# Altium schematic sheet Servo4.SchDoc
size 420 x 297 mm; SheetNumber: 27; SheetTotal: 32
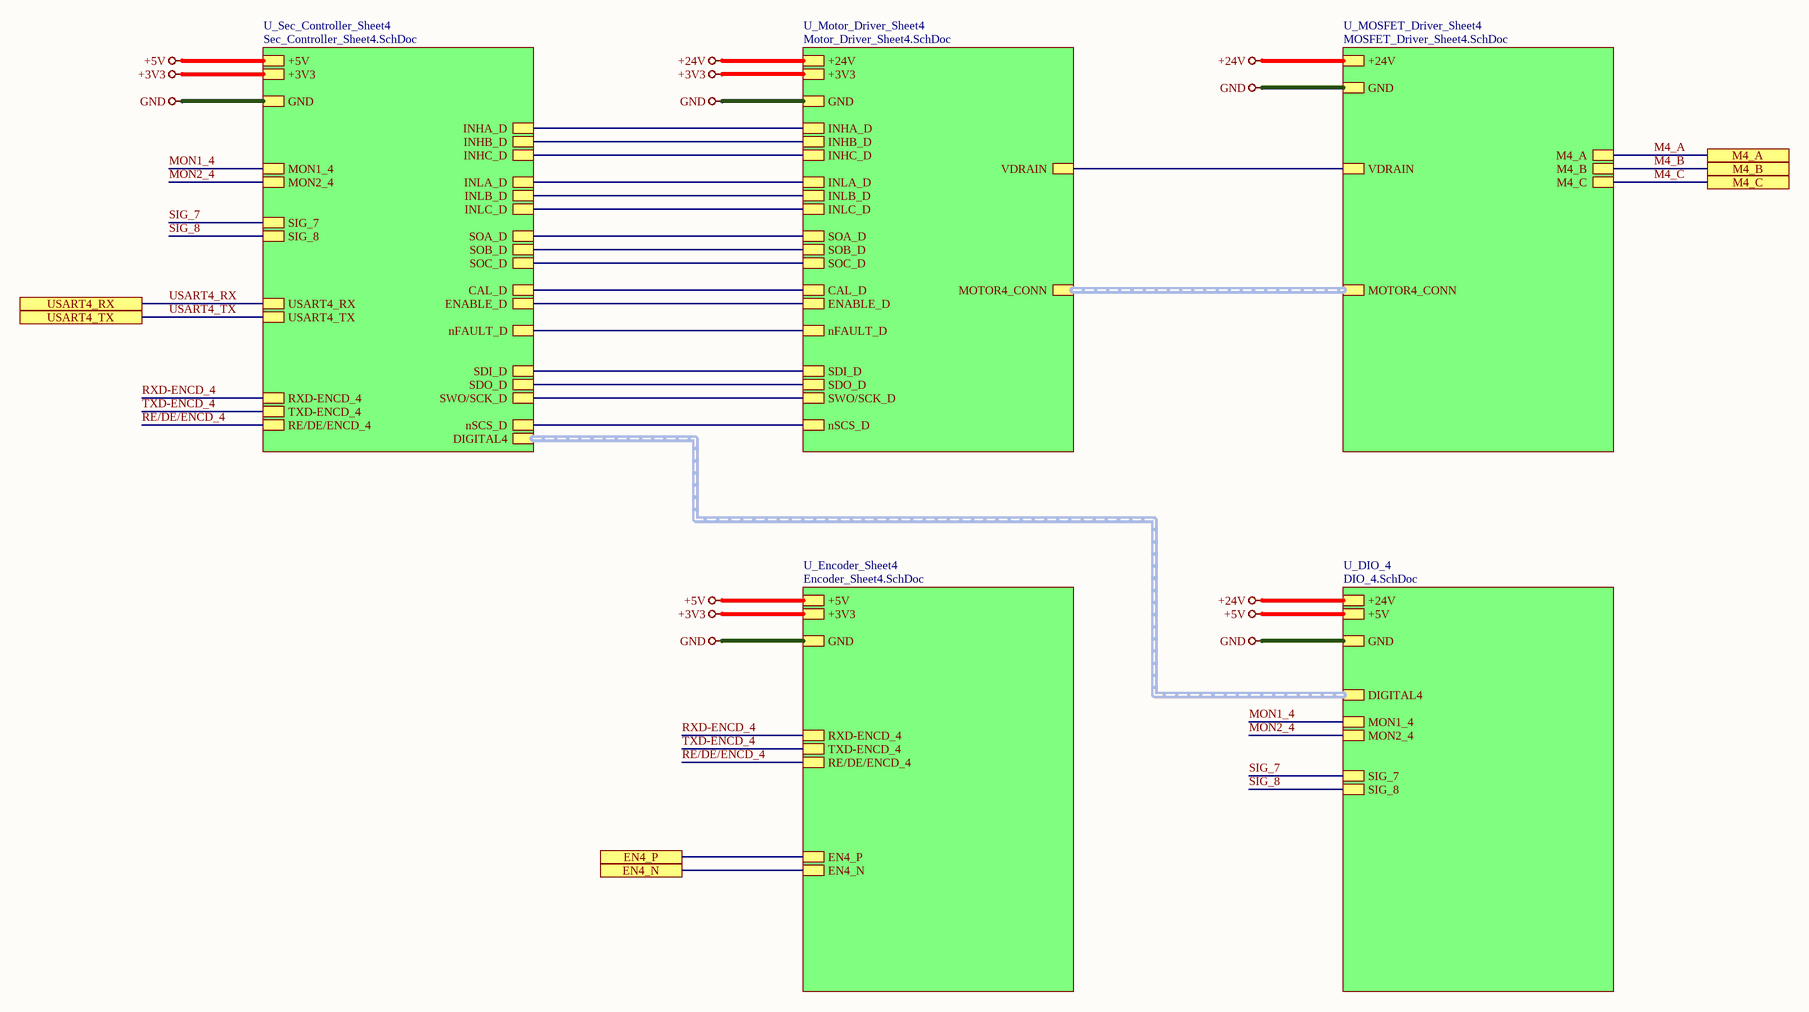
[diagram p0: Servo4.SchDoc]

## Sub-sheets
U_DIO_4 = DIO_4.SchDoc: +24V, +5V, GND, MON1_4, MON2_4, SIG_7, SIG_8, DIGITAL4 (harness DIGITAL1)
U_Encoder_Sheet4 = Encoder_Sheet4.SchDoc: +3V3, +5V, GND, EN4_N, EN4_P, RXD-ENCD_4, TXD-ENCD_4, RE/DE/ENCD_4
U_MOSFET_Driver_Sheet4 = MOSFET_Driver_Sheet4.SchDoc: +24V, GND, MOTOR4_CONN (harness MOTOR4_CONN), M4_A, M4_B, M4_C, VDRAIN
U_Motor_Driver_Sheet4 = Motor_Driver_Sheet4.SchDoc: +24V, +3V3, GND, MOTOR4_CONN (harness MOTOR4_CONN), INHA_D, INHB_D, INHC_D, INLA_D, INLB_D, INLC_D, nSCS_D, SDI_D, SDO_D, SWO/SCK_D, SOC_D, SOB_D, SOA_D, CAL_D, ENABLE_D, VDRAIN, nFAULT_D
U_Sec_Controller_Sheet4 = Sec_Controller_Sheet4.SchDoc: +3V3, GND, INHA_D, INHB_D, INHC_D, INLA_D, INLB_D, INLC_D, nSCS_D, SDI_D, SDO_D, SWO/SCK_D, SOC_D, SOB_D, SOA_D, CAL_D, ENABLE_D, nFAULT_D, USART4_RX, USART4_TX, RXD-ENCD_4, TXD-ENCD_4, RE/DE/ENCD_4, MON1_4, MON2_4, SIG_7, SIG_8, DIGITAL4 (harness DIGITAL1), +5V

## Ports
EN4_N (see Top_Sheet[6B], Connector_Sheet[3D], Encoder_Sheet4[2D]), EN4_P (see Top_Sheet[6B], Connector_Sheet[3D], Encoder_Sheet4[2D]), M4_A (see Top_Sheet[6C], Connector_Sheet[4D], MOSFET_Driver_Sheet4[3D]), M4_B (see Top_Sheet[6C], Connector_Sheet[4D], MOSFET_Driver_Sheet4[3D]), M4_C (see Top_Sheet[6C], Connector_Sheet[4D], MOSFET_Driver_Sheet4[3D]), USART4_RX (see Top_Sheet[6B], Controller_Sheet[2D], Sec_Controller_Sheet4[1D]), USART4_TX (see Top_Sheet[6B], Controller_Sheet[2D], Sec_Controller_Sheet4[1D])

## Nets
+3V3: sheet U_Motor_Driver_Sheet4/+3V3, sheet U_Sec_Controller_Sheet4/+3V3, sheet U_Encoder_Sheet4/+3V3
+5V: sheet U_Sec_Controller_Sheet4/+5V, sheet U_Encoder_Sheet4/+5V, sheet U_DIO_4/+5V
+24V: sheet U_MOSFET_Driver_Sheet4/+24V, sheet U_Motor_Driver_Sheet4/+24V, sheet U_DIO_4/+24V
GND: sheet U_MOSFET_Driver_Sheet4/GND, sheet U_Motor_Driver_Sheet4/GND, sheet U_Sec_Controller_Sheet4/GND, sheet U_Encoder_Sheet4/GND, sheet U_DIO_4/GND
EN4_N: port EN4_N, sheet U_Encoder_Sheet4/EN4_N
EN4_P: port EN4_P, sheet U_Encoder_Sheet4/EN4_P
M4_A: port M4_A, sheet U_MOSFET_Driver_Sheet4/M4_A
M4_B: port M4_B, sheet U_MOSFET_Driver_Sheet4/M4_B
M4_C: port M4_C, sheet U_MOSFET_Driver_Sheet4/M4_C
MON1_4: sheet U_Sec_Controller_Sheet4/MON1_4, sheet U_DIO_4/MON1_4
MON2_4: sheet U_Sec_Controller_Sheet4/MON2_4, sheet U_DIO_4/MON2_4
RE/DE/ENCD_4: sheet U_Sec_Controller_Sheet4/RE/DE/ENCD_4, sheet U_Encoder_Sheet4/RE/DE/ENCD_4
RXD-ENCD_4: sheet U_Sec_Controller_Sheet4/RXD-ENCD_4, sheet U_Encoder_Sheet4/RXD-ENCD_4
SIG_7: sheet U_Sec_Controller_Sheet4/SIG_7, sheet U_DIO_4/SIG_7
SIG_8: sheet U_Sec_Controller_Sheet4/SIG_8, sheet U_DIO_4/SIG_8
TXD-ENCD_4: sheet U_Sec_Controller_Sheet4/TXD-ENCD_4, sheet U_Encoder_Sheet4/TXD-ENCD_4
USART4_RX: port USART4_RX, sheet U_Sec_Controller_Sheet4/USART4_RX
USART4_TX: port USART4_TX, sheet U_Sec_Controller_Sheet4/USART4_TX
(unnamed): sheet U_MOSFET_Driver_Sheet4/VDRAIN, sheet U_Motor_Driver_Sheet4/VDRAIN
(unnamed): sheet U_Motor_Driver_Sheet4/INHA_D, sheet U_Sec_Controller_Sheet4/INHA_D
(unnamed): sheet U_Motor_Driver_Sheet4/INHB_D, sheet U_Sec_Controller_Sheet4/INHB_D
(unnamed): sheet U_Motor_Driver_Sheet4/INHC_D, sheet U_Sec_Controller_Sheet4/INHC_D
(unnamed): sheet U_Motor_Driver_Sheet4/INLA_D, sheet U_Sec_Controller_Sheet4/INLA_D
(unnamed): sheet U_Motor_Driver_Sheet4/INLB_D, sheet U_Sec_Controller_Sheet4/INLB_D
(unnamed): sheet U_Motor_Driver_Sheet4/INLC_D, sheet U_Sec_Controller_Sheet4/INLC_D
(unnamed): sheet U_Motor_Driver_Sheet4/nSCS_D, sheet U_Sec_Controller_Sheet4/nSCS_D
(unnamed): sheet U_Motor_Driver_Sheet4/SDI_D, sheet U_Sec_Controller_Sheet4/SDI_D
(unnamed): sheet U_Motor_Driver_Sheet4/SDO_D, sheet U_Sec_Controller_Sheet4/SDO_D
(unnamed): sheet U_Motor_Driver_Sheet4/SWO/SCK_D, sheet U_Sec_Controller_Sheet4/SWO/SCK_D
(unnamed): sheet U_Motor_Driver_Sheet4/SOC_D, sheet U_Sec_Controller_Sheet4/SOC_D
(unnamed): sheet U_Motor_Driver_Sheet4/SOB_D, sheet U_Sec_Controller_Sheet4/SOB_D
(unnamed): sheet U_Motor_Driver_Sheet4/SOA_D, sheet U_Sec_Controller_Sheet4/SOA_D
(unnamed): sheet U_Motor_Driver_Sheet4/CAL_D, sheet U_Sec_Controller_Sheet4/CAL_D
(unnamed): sheet U_Motor_Driver_Sheet4/ENABLE_D, sheet U_Sec_Controller_Sheet4/ENABLE_D
(unnamed): sheet U_Motor_Driver_Sheet4/nFAULT_D, sheet U_Sec_Controller_Sheet4/nFAULT_D

## Buses and harness runs
harness sheet U_DIO_4/DIGITAL4 = sheet U_Sec_Controller_Sheet4/DIGITAL4
harness sheet U_MOSFET_Driver_Sheet4/MOTOR4_CONN = sheet U_Motor_Driver_Sheet4/MOTOR4_CONN

## Notes on the sheet
- File:
- Title:
- Date:
- Page
- Num:
- Total:
- Drawn By: Huzaifa Ali